# EAGLE design xbee_compat (EAGLE 6.1)
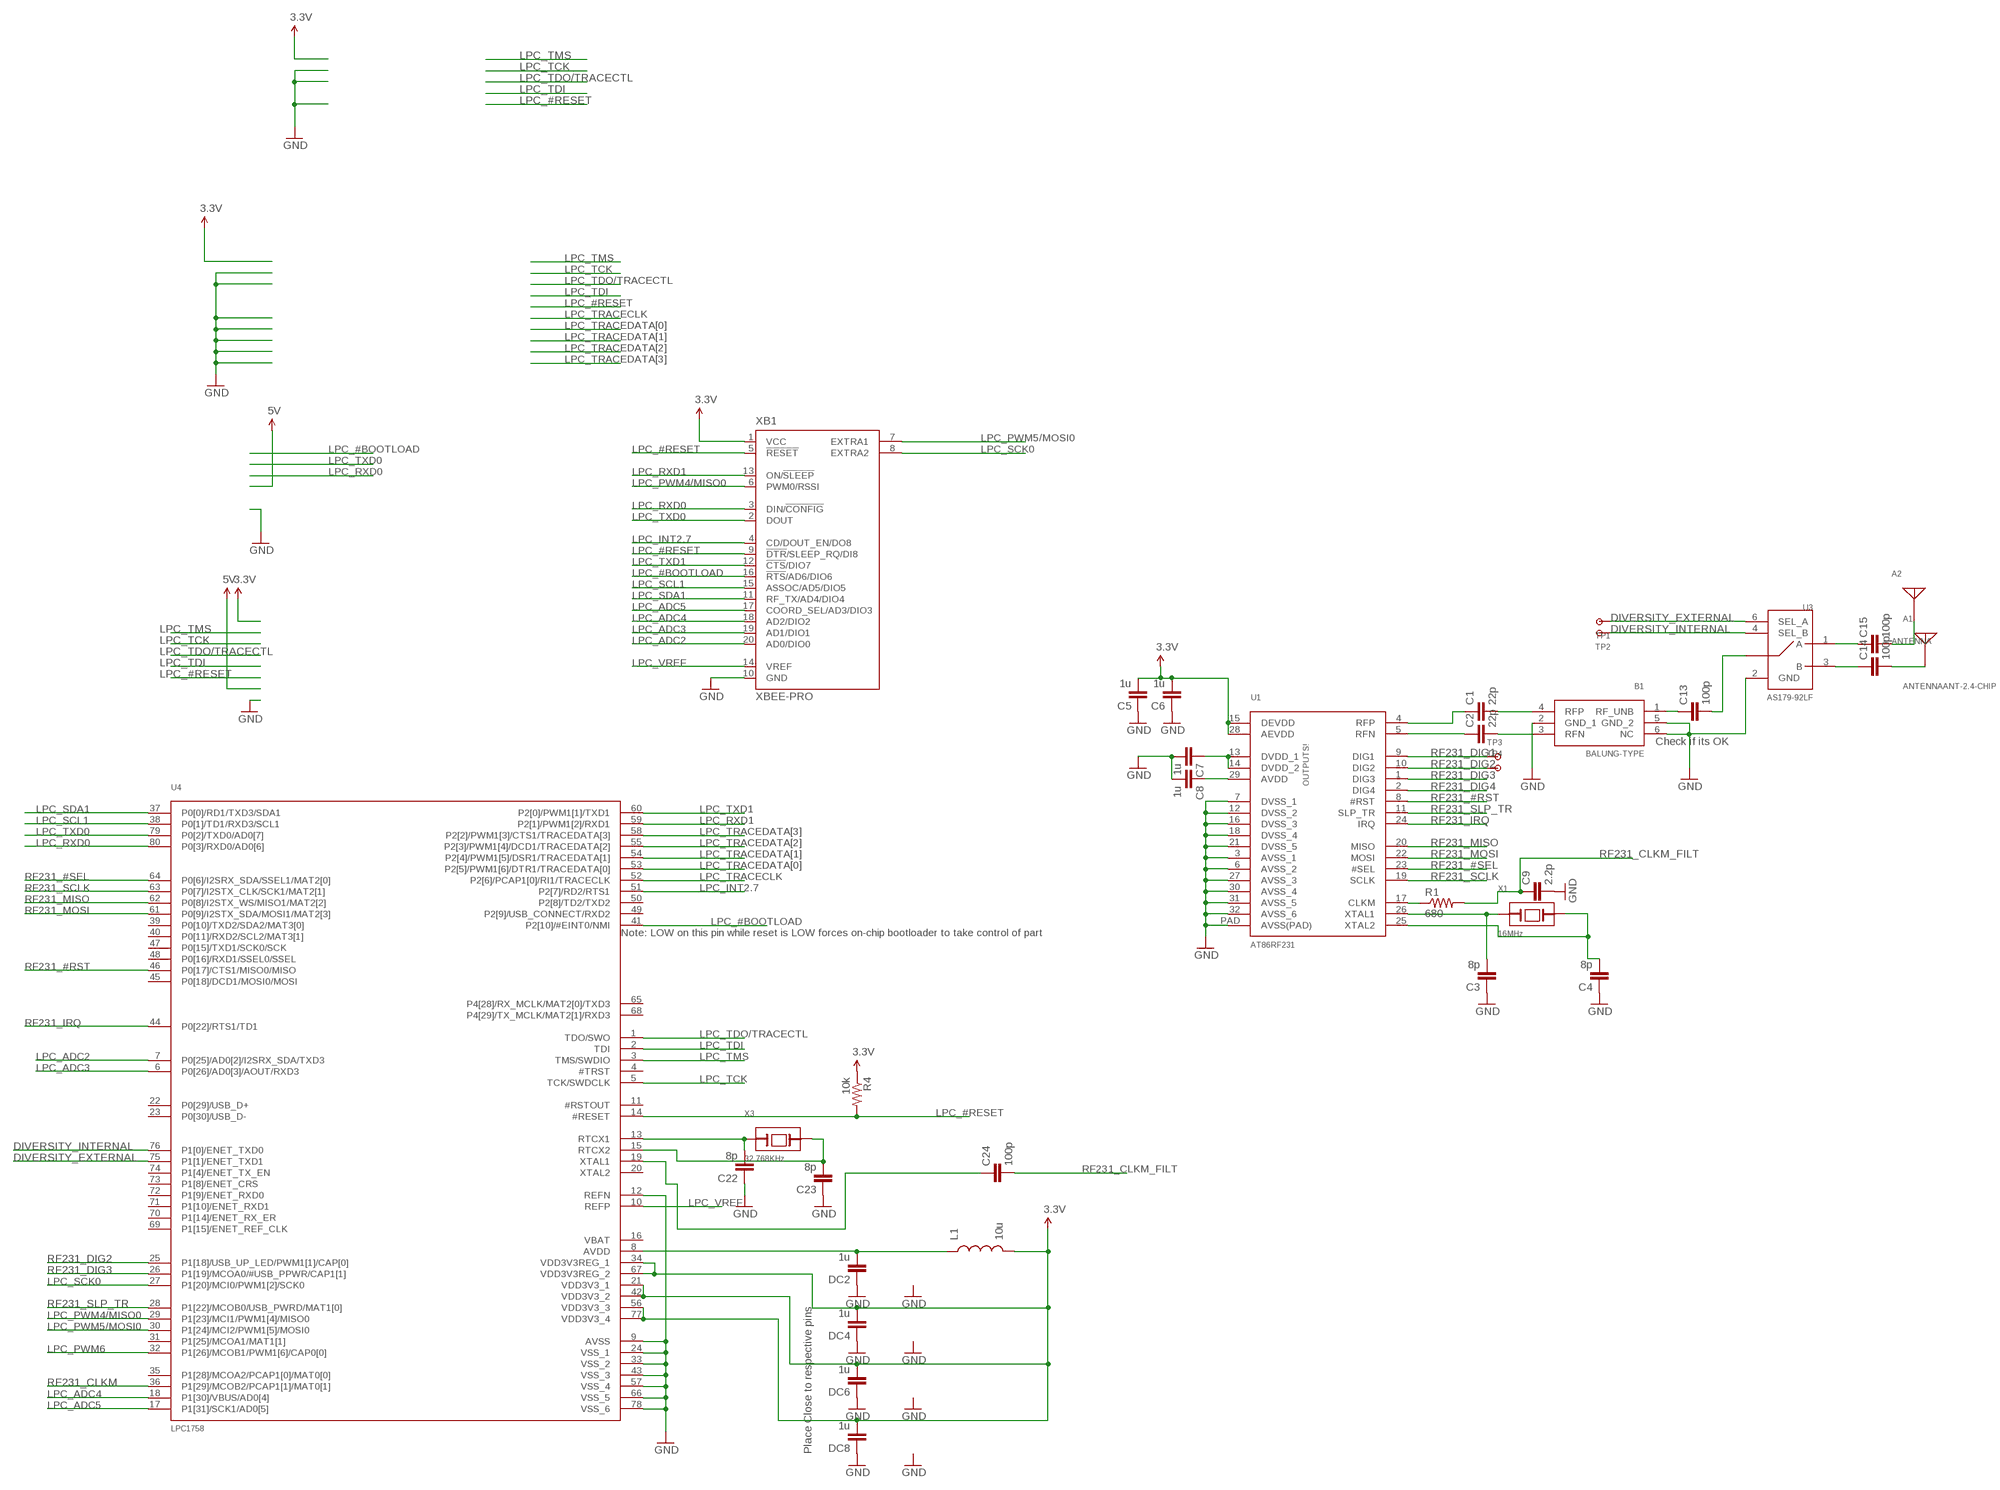
[diagram p0: schematic, sheet 1]

## Parts
A1  ANTENNAANT-2.4-CHIP  [ANT-2.4-CHP]
A2  ANTENNA  [CONREVSMA003.031]
B1  BALUNG-TYPE  [MURATA_LDB_BALUN]
C1  22p  CAP0402  [C0402]
C2  22p  CAP0402  [C0402]
C3  8p  CAP0402  [C0402]
C4  8p  CAP0402  [C0402]
C5  1u  CAP0402  [C0402]
C6  1u  CAP0402  [C0402]
C7  1u  CAP0402  [C0402]
C8  1u  CAP0402  [C0402]
C9  2.2p  CAP0402  [C0402]
C13  100p  CAP0402  [C0402]
C14  100p  CAP0402  [C0402]
C15  100p  CAP0402  [C0402]
C22  8p  CAP0402  [C0402]
C23  8p  CAP0402  [C0402]
C24  100p  CAP0402  [C0402]
DC2  1u  CAP0402  [C0402]
DC4  1u  CAP0402  [C0402]
DC6  1u  CAP0402  [C0402]
DC8  1u  CAP0402  [C0402]
L1  10u  INDUCTOR0603  [0603]
R1  680  RESISTOR0402  [C0402]
R4  10k  RESISTOR0402  [C0402]
TP1  TESTPOINTSMALLEST  [TESTPOINT]
TP2  TESTPOINTSMALLEST  [TESTPOINT]
TP3  TESTPOINTSMALLEST  [TESTPOINT]
TP4  TESTPOINTSMALLEST  [TESTPOINT]
U1  AT86RF231  [ATRF231_32QN2]
U3  AS179-92LF  [SC-70]
U4  LPC1758  [LPC1758_LQFP80]
X1  16MHz  XTALCX3225SA  [CX3225SA]
X3  32.768KHz  XTALABS07  [ABS07]
XB1  XBEE-PRO  [XBEE-PRO]

## Nets
3.3V [Power]: C5.2 C6.2 DC4.2 DC6.2 DC8.2 L1.2 R4.1 U1.15(DEVDD) U1.28(AEVDD) U4.21(VDD3V3_1) U4.34(VDD3V3REG_1) U4.42(VDD3V3_2) U4.56(VDD3V3_3) U4.67(VDD3V3REG_2) U4.77(VDD3V3_4) XB1.1(VCC)
DIVERSITY_EXTERNAL: TP1.P$1 U3.6(SEL_A) U4.75(P1[1]/ENET_TXD1)
DIVERSITY_INTERNAL: TP2.P$1 U3.4(SEL_B) U4.76(P1[0]/ENET_TXD0)
GND [Power]: B1.2(GND_1) B1.5(GND_2) B1.6(NC) C3.1 C4.1 C5.1 C6.1 C7.2 C8.2 C9.2 C22.1 C23.1 DC2.1 DC4.1 DC6.1 DC8.1 U1.3(AVSS_1) U1.6(AVSS_2) U1.7(DVSS_1) U1.12(DVSS_2) U1.16(DVSS_3) U1.18(DVSS_4) U1.21(DVSS_5) U1.27(AVSS_3) U1.30(AVSS_4) U1.31(AVSS_5) U1.32(AVSS_6) U1.PAD(AVSS(PAD)) U3.2(GND) U4.9(AVSS) U4.12(REFN) U4.24(VSS_1) U4.33(VSS_2) U4.43(VSS_3) U4.57(VSS_4) U4.66(VSS_5) U4.78(VSS_6) XB1.10(GND)
LPC_#BOOTLOAD: U4.41(P2[10]/#EINT0/NMI) XB1.16(!RTS!/AD6/DIO6)
LPC_#RESET: R4.2 U4.14(#RESET) XB1.5(!RESET) XB1.9(!DTR!/SLEEP_RQ/DI8)
LPC_ADC2: U4.7(P0[25]/AD0[2]/I2SRX_SDA/TXD3) XB1.20(AD0/DIO0)
LPC_ADC3: U4.6(P0[26]/AD0[3]/AOUT/RXD3) XB1.19(AD1/DIO1)
LPC_ADC4: U4.18(P1[30]/VBUS/AD0[4]) XB1.18(AD2/DIO2)
LPC_ADC5: U4.17(P1[31]/SCK1/AD0[5]) XB1.17(COORD_SEL/AD3/DIO3)
LPC_INT2.7: U4.51(P2[7]/RD2/RTS1) XB1.4(CD/DOUT_EN/DO8)
LPC_PWM4/MISO0: U4.29(P1[23]/MCI1/PWM1[4]/MISO0) XB1.6(PWM0/RSSI)
LPC_PWM5/MOSI0: U4.30(P1[24]/MCI2/PWM1[5]/MOSI0) XB1.7(EXTRA1)
LPC_PWM6: U4.32(P1[26]/MCOB1/PWM1[6]/CAP0[0])
LPC_RXD0: U4.80(P0[3]/RXD0/AD0[6]) XB1.3(DIN/!CONFIG)
LPC_RXD1: U4.59(P2[1]/PWM1[2]/RXD1) XB1.13(ON/!SLEEP)
LPC_SCK0: U4.27(P1[20]/MCI0/PWM1[2]/SCK0) XB1.8(EXTRA2)
LPC_SCL1: U4.38(P0[1]/TD1/RXD3/SCL1) XB1.15(ASSOC/AD5/DIO5)
LPC_SDA1: U4.37(P0[0]/RD1/TXD3/SDA1) XB1.11(RF_TX/AD4/DIO4)
LPC_TCK: U4.5(TCK/SWDCLK)
LPC_TDI: U4.2(TDI)
LPC_TDO/TRACECTL: U4.1(TDO/SWO)
LPC_TMS: U4.3(TMS/SWDIO)
LPC_TRACECLK: U4.52(P2[6]/PCAP1[0]/RI1/TRACECLK)
LPC_TRACEDATA[0]: U4.53(P2[5]/PWM1[6]/DTR1/TRACEDATA[0])
LPC_TRACEDATA[1]: U4.54(P2[4]/PWM1[5]/DSR1/TRACEDATA[1])
LPC_TRACEDATA[2]: U4.55(P2[3]/PWM1[4]/DCD1/TRACEDATA[2])
LPC_TRACEDATA[3]: U4.58(P2[2]/PWM1[3]/CTS1/TRACEDATA[3])
LPC_TXD0: U4.79(P0[2]/TXD0/AD0[7]) XB1.2(DOUT)
LPC_TXD1: U4.60(P2[0]/PWM1[1]/TXD1) XB1.12(!CTS!/DIO7)
LPC_VREF: U4.10(REFP) XB1.14(VREF)
N$1 [RF]: B1.3(RFN) C2.2
N$2 [RF]: B1.4(RFP) C1.2
N$3: B1.1(RF_UNB) C13.1
N$4 [RF]: C2.1 U1.5(RFN)
N$5 [RF]: C1.1 U1.4(RFP)
N$6: C3.2 U1.26(XTAL1) X1.3(A)
N$7: C4.2 U1.25(XTAL2) X1.1(B)
N$9: C8.1 U1.29(AVDD)
N$10: C7.1 U1.13(DVDD_1) U1.14(DVDD_2)
N$14: R1.1 U1.17(CLKM)
N$15 [RF]: C13.2 U3.5(W)
N$16 [RF]: C14.1 U3.3(B)
N$17 [RF]: C15.1 U3.1(A)
N$19 [RF]: A1.CON C14.2
N$20 [RF]: A2.CON C15.2
N$24: DC2.2 L1.1 U4.8(AVDD)
N$25: C22.2 U4.13(RTCX1) X3.1(A)
N$26: C23.2 U4.15(RTCX2) X3.2(B)
N$27: C24.1 U4.19(XTAL1)
RF231_#RST: U1.8(#RST) U4.46(P0[17]/CTS1/MISO0/MISO)
RF231_#SEL: U1.23(#SEL) U4.64(P0[6]/I2SRX_SDA/SSEL1/MAT2[0])
RF231_CLKM: U4.36(P1[29]/MCOB2/PCAP1[1]/MAT0[1])
RF231_CLKM_FILT: C9.1 C24.2 R1.2
RF231_DIG1: TP3.P$1 U1.9(DIG1)
RF231_DIG2: TP4.P$1 U1.10(DIG2) U4.25(P1[18]/USB_UP_LED/PWM1[1]/CAP[0])
RF231_DIG3: U1.1(DIG3) U4.26(P1[19]/MCOA0/#USB_PPWR/CAP1[1])
RF231_DIG4: U1.2(DIG4)
RF231_IRQ: U1.24(IRQ) U4.44(P0[22]/RTS1/TD1)
RF231_MISO: U1.20(MISO) U4.62(P0[8]/I2STX_WS/MISO1/MAT2[2])
RF231_MOSI: U1.22(MOSI) U4.61(P0[9]/I2STX_SDA/MOSI1/MAT2[3])
RF231_SCLK: U1.19(SCLK) U4.63(P0[7]/I2STX_CLK/SCK1/MAT2[1])
RF231_SLP_TR: U1.11(SLP_TR) U4.28(P1[22]/MCOB0/USB_PWRD/MAT1[0])
Unconnected: U4.4(#TRST) U4.11(#RSTOUT) U4.16(VBAT) U4.20(XTAL2) U4.22(P0[29]/USB_D+) U4.23(P0[30]/USB_D-) U4.31(P1[25]/MCOA1/MAT1[1]) U4.35(P1[28]/MCOA2/PCAP1[0]/MAT0[0]) U4.39(P0[10]/TXD2/SDA2/MAT3[0]) U4.40(P0[11]/RXD2/SCL2/MAT3[1]) U4.45(P0[18]/DCD1/MOSI0/MOSI) U4.47(P0[15]/TXD1/SCK0/SCK) U4.48(P0[16]/RXD1/SSEL0/SSEL) U4.49(P2[9]/USB_CONNECT/RXD2) U4.50(P2[8]/TD2/TXD2) U4.65(P4[28]/RX_MCLK/MAT2[0]/TXD3) U4.68(P4[29]/TX_MCLK/MAT2[1]/RXD3) U4.69(P1[15]/ENET_REF_CLK) U4.70(P1[14]/ENET_RX_ER) U4.71(P1[10]/ENET_RXD1) U4.72(P1[9]/ENET_RXD0) U4.73(P1[8]/ENET_CRS) U4.74(P1[4]/ENET_TX_EN)

## Notes on the sheet
- Check if its OK
- Note: LOW on this pin while reset is LOW forces on-chip bootloader to take control of part
- Place Close to respective pins

## Library data of the parts
A1 A2 = WSNlib:ANTENNA: Antennas ANT-2.4-CHP-x RPSMA connector
B1 = WSNlib:BALUN
C1-C9 C13-C15 C22-C24 DC2 DC4 DC6 DC8 = SparkFun:CAP: Capacitor Standard 0603 ceramic capacitor, and 0.1" leaded capacitor.
L1 = SparkFun:INDUCTOR: Inductors Basic Inductor/Choke - 0603 and 1206. Footprints are not proven and vary greatly between part numbers.
R1 R4 = SparkFun:RESISTOR: Resistor Basic schematic elements and footprints for 0603, 1206, and PTH 1/10th watt (small) resistors.
TP1-TP4 = WSNlib:TESTPOINT: Generic Testpoint
U1 = WSNlib:AT86RF231: ATRF231 Radio Tranciever
U3 = WSNlib:AS179-92LF: AS179-92LF 2.4GHz GaAs SPDT Switch
U4 = WSNlib:LPC1758
X1 X3 = WSNlib:XTAL: Crystals used in OpenMote
XB1 = WSNlib:XBEE: XBee (TM) /XBee-PRO(TM) OEM RF Modules Source: MaxStream, Inc. xbee_productmanual.pdf

## Net classes
0 default: width 0.152 mm, drill 0.152 mm, clearance 0.152 mm
1 RF: width 0.254 mm, drill 2.54 mm, clearance 0.152 mm
2 Power: width 0.152 mm, drill 0.152 mm, clearance 0.152 mm

## Board
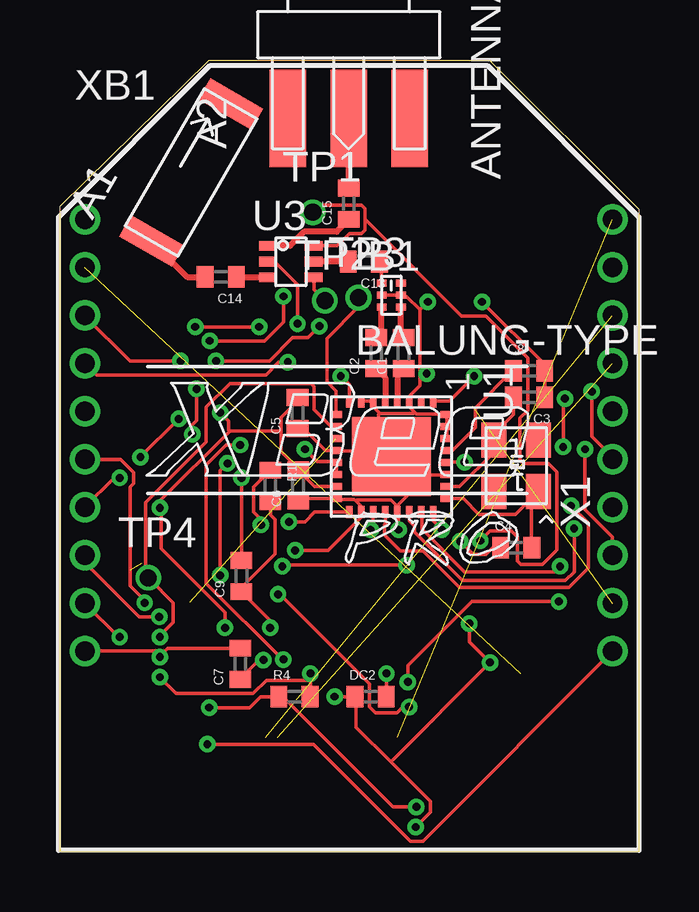
[diagram p1: board, top side]
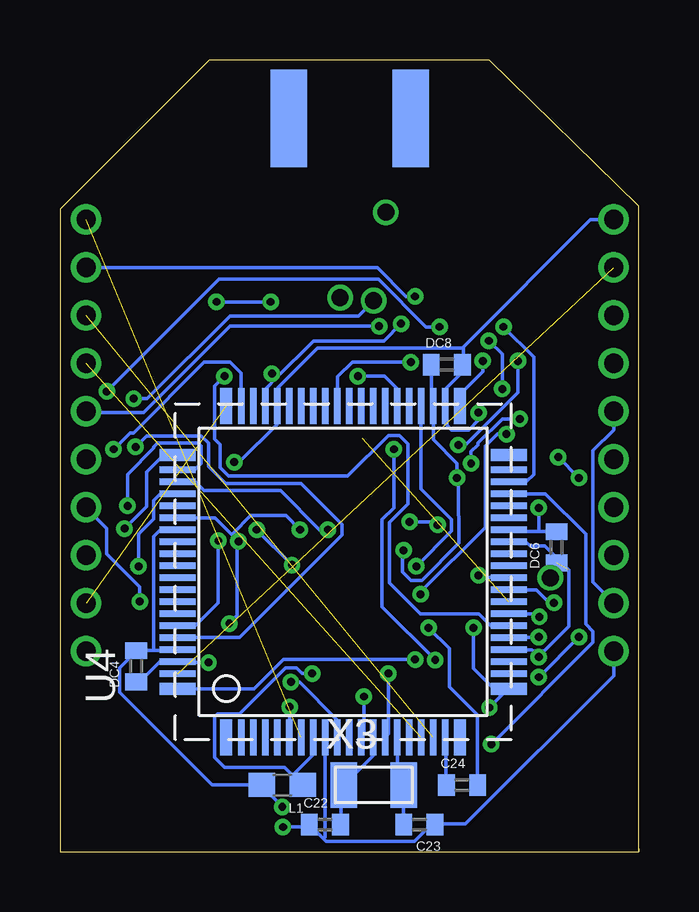
[diagram p2: board, bottom side, seen from below]

Size 24.13 x 33.02 mm. Coordinates in mm from the lower left corner, seen from the top.
Outline: 0,0 0,0.13
Outline: 0,0.13 0,26.92 6.22,33.02 17.91,33.02 24.13,26.8 24.13,0 0,0
Outline: 0,0 0,0.13
Outline: 0,0.13 0,0
Copper layers (1*16): Top 0.0356mm / dielectric 1.5011mm / Bottom 0.0356mm
Design rules: minimum track width 6mil, minimum drill 13mil, track to track 6mil, track to pad 6mil, pad to pad 6mil, via to via 6mil, smd to smd 6mil, copper to edge 15mil, drill to drill 6mil, minimum pad ring 7mil, minimum via ring 7mil, stop-mask expansion 4mil, vias tented up to drill 0mil, thermal gap 10mil
tRestrict: area 1.3,25.3 to 8.6,32.8

### Footprints (pad centres in the part's own frame; a part is rotated, then mirrored left to right if it is on the bottom)
ANT-2.4-CHP = smd 1.016 x 2.54: CON -3.302,0; MEC 3.302,0
CONREVSMA003.031 = smd 1.524 x 4.064: CON 0,0; GND_2 -2.54,0; GND_4 2.54,0 | smd 1.524 x 4.064 bottom: GND_1 -2.54,0; GND_3 2.54,0
MURATA_LDB_BALUN = smd 0.4 x 0.3: 1 -0.4,0.5; 2 -0.4,0; 3 -0.4,-0.5; 4 0.4,-0.5; 5 0.4,0; 6 0.4,0.5
C0402 = smd 0.7 x 0.9: 1 -0.65,0; 2 0.65,0
0603 = smd 1.1 x 1: 1 -0.85,0; 2 0.85,0
TESTPOINT = drill 0.711 pad 1.016: P$1 0,0
ATRF231_32QN2 = smd 0.5 x 0.28: 1 -2.3,1.75; 2 -2.3,1.25; 3 -2.3,0.75; 4 -2.3,0.25; 5 -2.3,-0.25; 6 -2.3,-0.75; 7 -2.3,-1.25; 8 -2.3,-1.75; 17 2.3,-1.75; 18 2.3,-1.25; 19 2.3,-0.75; 20 2.3,-0.25; 21 2.3,0.25; 22 2.3,0.75; 23 2.3,1.25; 24 2.3,1.75 | smd 0.28 x 0.5: 9 -1.75,-2.3; 10 -1.25,-2.3; 11 -0.75,-2.3; 12 -0.25,-2.3; 13 0.25,-2.3; 14 0.75,-2.3; 15 1.25,-2.3; 16 1.75,-2.3; 25 1.75,2.3; 26 1.25,2.3; 27 0.75,2.3; 28 0.25,2.3; 29 -0.25,2.3; 30 -0.75,2.3; 31 -1.25,2.3; 32 -1.75,2.3 | smd 3.3 x 3.3: PAD 0,0
SC-70 = smd 0.75 x 0.4: 1 -0.95,0.65; 2 -0.95,0; 3 -0.95,-0.65; 4 0.95,-0.65; 5 0.95,0; 6 0.95,0.65
LPC1758_LQFP80 = smd 1.5 x 0.5: 1 -6.9,4.875; 20 -6.9,-4.875; 41 6.9,-4.875; 60 6.9,4.875 | smd 1.5 x 0.28: 2 -6.9,4.25; 3 -6.9,3.75; 4 -6.9,3.25; 5 -6.9,2.75; 6 -6.9,2.25; 7 -6.9,1.75; 8 -6.9,1.25; 9 -6.9,0.75; 10 -6.9,0.25; 11 -6.9,-0.25; 12 -6.9,-0.75; 13 -6.9,-1.25; 14 -6.9,-1.75; 15 -6.9,-2.25; 16 -6.9,-2.75; 17 -6.9,-3.25; 18 -6.9,-3.75; 19 -6.9,-4.25; 42 6.9,-4.25; 43 6.9,-3.75; 44 6.9,-3.25; 45 6.9,-2.75; 46 6.9,-2.25; 47 6.9,-1.75; 48 6.9,-1.25; 49 6.9,-0.75; 50 6.9,-0.25; 51 6.9,0.25; 52 6.9,0.75; 53 6.9,1.25; 54 6.9,1.75; 55 6.9,2.25; 56 6.9,2.75; 57 6.9,3.25; 58 6.9,3.75; 59 6.9,4.25 | smd 0.5 x 1.5: 21 -4.875,-6.9; 40 4.875,-6.9; 61 4.875,6.9; 80 -4.875,6.9 | smd 0.28 x 1.5: 22 -4.25,-6.9; 23 -3.75,-6.9; 24 -3.25,-6.9; 25 -2.75,-6.9; 26 -2.25,-6.9; 27 -1.75,-6.9; 28 -1.25,-6.9; 29 -0.75,-6.9; 30 -0.25,-6.9; 31 0.25,-6.9; 32 0.75,-6.9; 33 1.25,-6.9; 34 1.75,-6.9; 35 2.25,-6.9; 36 2.75,-6.9; 37 3.25,-6.9; 38 3.75,-6.9; 39 4.25,-6.9; 62 4.25,6.9; 63 3.75,6.9; 64 3.25,6.9; 65 2.75,6.9; 66 2.25,6.9; 67 1.75,6.9; 68 1.25,6.9; 69 0.75,6.9; 70 0.25,6.9; 71 -0.25,6.9; 72 -0.75,6.9; 73 -1.25,6.9; 74 -1.75,6.9; 75 -2.25,6.9; 76 -2.75,6.9; 77 -3.25,6.9; 78 -3.75,6.9; 79 -4.25,6.9
CX3225SA = smd 1.45 x 1.05: 1 -1.075,-0.925; 2 1.075,-0.925; 3 1.075,0.925; 4 -1.075,0.925
ABS07 = smd 1.1 x 1.9: 1 -1.25,0; 2 1.25,0
XBEE-PRO = drill 0.8 pad 1.27: 1 -11,9; 2 -11,7; 3 -11,5; 4 -11,3; 5 -11,1; 6 -11,-1; 7 -11,-3; 8 -11,-5; 9 -11,-7; 10 -11,-9; 11 11,-9; 12 11,-7; 13 11,-5; 14 11,-3; 15 11,-1; 16 11,1; 17 11,3; 18 11,5; 19 11,7; 20 11,9

### Placement (x,y rotation side)
A1  5.47,28.33 60 top
A2  12.04,30.58 0 top
B1  13.82,23.22 0 top
C1  14.33,20.8 90 top
C2  13.18,20.8 90 top
C3  19.56,18.96 180 top
C4  19.02,12.69 0 top
C5  9.91,18.3 90 top
C6  9.93,15.28 90 top
C7  7.52,7.85 90 top
C8  19.56,20.07 0 top
C9  7.57,11.51 90 top
C13  12.67,24.61 180 top
C14  6.71,23.98 180 top
C15  12.04,27.03 90 top
C22  13.08,1.14 0 bottom
C23  9.14,1.14 180 bottom
C24  7.37,2.79 0 bottom
DC2  12.95,6.48 0 top
DC4  20.95,7.75 90 bottom
DC6  3.43,12.7 90 bottom
DC8  8,20.32 0 bottom
L1  14.86,2.79 180 bottom
R1  8.78,15.27 270 top
R4  9.78,6.48 0 top
TP1  10.54,26.67 0 top
TP2  11.05,22.99 0 top
TP3  12.45,23.11 0 top
TP4  3.68,11.43 0 top
U1  13.82,16.48 270 top
U3  9.63,24.61 0 top
U4  12.32,11.68 90 bottom
X1  19.02,16.1 90 top
X3  11.05,2.79 0 bottom
XB1  12.04,17.37 0 top

### Tracks (layer width: path | path; a pad name or v marks a point on that pad's centre or on a via)
3.3V  (via drill 0.33)
  Top 0.152: v6.22,6.02 7.9,6.02 8.36,6.48 9.12,6.48 R4.1 9.2,6.45 9.32,6.45 13.89,1.88 v14.86,1.88 | U1.15 11.51,15.24 10.62,15.24 C6.2 9.91,16 9.22,16.69 9.22,17.55 | 9.22,17.55 9.22,18.11 9.91,18.8 C5.2 | 7.09,17.55 4.17,14.63 v4.17,14.35 4.22,14.3 4.22,12.65 6.88,9.98 v6.88,9.35 | 7.09,17.55 9.17,17.55 9.22,17.55 | v16.87,16.26 16.13,16.26 U1.28 | v6.68,18.31 7.04,17.96 7.04,17.6 7.09,17.55
  Bottom 0.152: 5.74,6.5 5.44,6.81 U4.21 | 5.74,6.5 v6.22,6.02 | 20.22,8.41 19.25,8.41 U4.77 | 20.22,8.41 DC4.2 20.98,8.33 21.64,7.67 21.64,6.66 17.78,2.79 15.72,2.79 L1.2 15.72,2.74 v14.86,1.88 | U4.67 19.23,13.41 19.96,13.41 20.22,13.16 20.22,8.46 20.22,8.41 | 4.17,13.36 5.36,13.36 5.41,13.41 U4.34 | 4.17,13.36 DC6.2 | v4.17,14.35 4.17,13.41 4.17,13.36 | v16.87,16.26 16.66,16.26 15.09,17.83 15.09,18.57 U4.56 15.04,18.64 15.04,19.36 13.39,21.01 7.37,21.01 7.32,21.01 | 7.32,21.01 7.32,21.06 2.01,26.36 XB1.1 | 7.32,21.01 7.32,20.37 DC8.2 7.37,20.32 7.37,19.99 8.05,19.3 8.05,18.59 U4.42 8.05,18.52 8.05,17.86 7.8,17.6 7.09,17.6 6.68,18.01 v6.68,18.31 | v6.88,9.35 6.88,7.64 5.79,6.55 5.74,6.5
DIVERSITY_EXTERNAL  (via drill 0.33)
  Top 0.152: 12.72,26.31 12.72,26.82 12.57,26.98 10.85,26.98 TP1.P$1 | 12.72,26.31 12.72,25.93 12.57,25.78 12.06,25.78 11.56,25.27 10.59,25.27 U3.6 | v17.53,12.98 17.93,13.39 18.82,13.39 19.07,13.13 19.07,12.14 19.23,11.99 20.12,11.99 20.73,12.6 20.73,15.85 20.37,16.2 19.33,16.2 19.18,16.36 19.18,18.09 19.51,18.41 19.51,20.6 17.75,22.35 16.74,22.35 12.78,26.31 12.72,26.31
  Bottom 0.152: v17.53,12.98 17.53,10.39 18.47,9.45 19.2,9.45 U4.75
DIVERSITY_INTERNAL  (via drill 0.33)
  Top 0.152: TP2.P$1 10.59,23.44 10.59,23.95 U3.4 | v20.98,16.89 20.98,18.82 v21.06,18.9
  Bottom 0.152: v20.98,16.89 20.52,17.35 18.24,17.35 17.93,17.04 17.93,16.08 17.22,15.37 14.07,15.37 12.37,13.66 12.37,13.21 16.64,8.94 19.2,8.94 U4.76 | v21.06,18.9 20.5,18.9 17.04,22.35 11.68,22.35 TP2.P$1
GND  (via drill 0.33)  (1 unrouted)
  Top 0.152: v7.57,15.6 C9.2 | v16.69,12.95 17.25,12.39 17.75,12.39 18.03,12.68 18.36,12.68 C4.1 | C6.1 10.03,14.73 11.51,14.73 U1.16 11.58,14.71 12.27,14.71 12.34,14.63 | 12.34,14.63 12.55,14.43 12.55,14.2 U1.18 12.55,14.12 12.55,13.95 11.18,12.57 v9.8,12.57 | 14.05,14.43 14.05,14.2 U1.21 14.12,14.15 v14.12,13.44 | 14.05,14.43 13.79,14.68 12.39,14.68 12.34,14.63 | 14.96,15.34 14.1,14.48 14.05,14.43 | 14.96,15.34 15.34,15.72 16.1,15.72 U1.27 | v9.91,22.02 9.91,23.65 8.94,24.61 U3.2 | C5.1 9.91,17.63 10.19,17.63 11.07,16.74 11.51,16.74 U1.12 11.58,16.71 13.59,16.71 U1.PAD | C3.1 20.22,18.97 C8.2 20.17,20.12 20.17,20.37 v17.6,22.94 | B1.2 13.44,23.22 14.2,23.22 B1.5 | B1.6 14.22,23.7 14.22,23.27 B1.5 | U1.7 12.57,18.8 13.06,18.8 U1.6 13.11,18.72 13.11,18.52 13.34,18.29 | U1.30 16.13,17.25 U1.31 16.13,17.8 16.13,18.21 U1.32 16.05,18.26 14.86,18.26 14.78,18.34 | 14.78,18.34 14.58,18.54 U1.3 14.61,18.85 14.61,19.05 15.01,19.46 15.01,19.94 | 13.34,18.29 14.73,18.29 14.78,18.34 | 15.01,22.61 14.45,23.16 14.28,23.16 B1.5 | 15.01,19.94 15.01,22.61 | v15.34,22.94 15.06,22.66 15.01,22.61 | U1.PAD 13.28,16.76 13.28,18.24 13.34,18.29 | v15.29,19.94 15.06,19.94 15.01,19.94 | 14.96,15.34 14.91,15.39 13.87,16.43 U1.PAD | 1.04,8.38 4.17,8.38 | 4.17,8.38 4.39,8.38 4.5,8.48 7.52,8.48 C7.2 | 1.04,8.38 XB1.10 | 1.04,8.38 XB1.10 | 1.04,8.38 XB1.10 | v4.17,8.13 4.17,8.33 4.17,8.38 | v11.46,6.48 DC2.1 12.34,6.43 12.34,5.21 13.79,3.76 | 13.79,3.76 15.44,2.11 15.44,1.65 v14.83,1.04 | 13.79,3.76 13.84,3.81 v17.93,7.9 17.88,7.95 17.07,8.76 v17.07,9.53
  Bottom 0.152: DC8.1 8.64,20.32 8.64,18.62 U4.43 8.56,18.57 8.56,17.2 7.57,16.2 v7.57,15.6 7.52,15.54 7.52,14.02 7.49,13.99 7.49,12.88 9.04,11.33 9.5,11.33 9.86,11.68 9.86,12.52 v9.8,12.57 | 16.97,13.23 17.65,13.92 19.2,13.92 U4.66 | 16.97,13.23 v16.69,12.95 16.74,12.9 16.74,9.86 v17.07,9.53 | v14.12,13.44 14.71,14.02 16.18,14.02 16.92,13.28 16.97,13.23 | v9.91,22.02 10.62,21.31 13.56,21.31 15.11,19.76 | 15.11,19.76 15.54,19.33 15.54,18.59 U4.57 | v15.34,22.94 v17.6,22.94 | v15.29,19.94 15.16,19.81 15.11,19.76 | 4.17,8.38 3.94,8.38 2.92,9.4 2.92,11.76 3.91,12.75 4.52,12.75 4.7,12.93 U4.33 | 4.17,8.38 4.39,8.38 4.45,8.43 U4.24 | v4.17,8.13 4.17,8.33 4.17,8.38 | DC4.1 20.95,7.11 20.78,7.11 19.96,7.92 U4.78 19.15,7.9 v17.93,7.9 | v11.46,6.48 11.46,4.9 11.56,4.8 U4.12 | 13.13,0.56 13.72,1.14 C22.1 13.72,1.04 v14.83,1.04 | 13.13,0.56 13.03,0.46 9.35,0.46 8.66,1.14 8.51,1.14 C23.1 8.43,1.17 7.21,1.17 1.04,7.34 1.04,8.36 XB1.10 | U4.9 13.08,0.61 13.13,0.56
LPC_#BOOTLOAD  (via drill 0.33)
  Top 0.152: v6.5,20.47 8.74,20.47 9.7,21.44 10.34,21.44 v10.82,21.92
  Bottom 0.152: v6.5,20.47 6.5,20.04 7.44,19.1 7.44,18.59 U4.41 | v10.82,21.92 17.04,21.92 20.65,18.31 22.99,18.31 XB1.16
LPC_#RESET  (via drill 0.33)
  Top 0.152: R4.2 v10.44,7.44 10.39,7.16 8.61,7.16 8.05,6.6 4.85,6.6 v4.17,7.29 | v2.49,8.97 2.44,8.97 XB1.9
  Bottom 0.152: v10.44,7.44 10.44,4.93 10.57,4.8 U4.14 | v2.49,8.97 v4.17,7.29 | XB1.5 1.04,17.6 1.91,16.74 1.91,11.25 1.04,10.39 XB1.9
LPC_ADC2  (1 unrouted)
LPC_ADC3  (via drill 0.33)
  Top 0.152: v14.55,6.04 14.3,6.04 14.05,5.79 13.16,5.79 12.9,6.04 12.9,7.01 9.17,10.74 v9.09,10.74 | v5.51,17.42 5.51,17.8 5.69,17.98 v5.69,19.3 | v6.25,21.31 8.53,21.31 9.32,22.1 v9.32,23.16
  Bottom 0.152: v14.55,6.04 14.55,4.8 U4.6 | v9.09,10.74 9.09,10.85 6.4,13.54 6.4,16.92 5.89,17.42 v5.51,17.42 | v5.69,19.3 5.69,20.75 v6.25,21.31 | v9.32,23.16 9.7,23.16 10.9,24.36 XB1.19
LPC_ADC4  (1 unrouted)
LPC_ADC5  (1 unrouted)
LPC_INT2.7  (via drill 0.33)
  Top 0.152: v9.5,20.42 9.12,20.42 8.59,19.89 1.52,19.89 XB1.4
  Bottom 0.152: v9.5,20.42 11.94,20.42 12.55,19.81 12.55,18.59 U4.51
LPC_PWM4/MISO0  (via drill 0.33)
  Top 0.152: v3.53,10.39 3.53,10.49 2.92,11.1 2.92,15.21 3.07,15.37 3.07,15.82 2.54,16.36 1.04,16.36 XB1.6
  Bottom 0.152: v3.53,10.39 3.73,10.39 4.27,10.92 U4.29
LPC_PWM5/MOSI0  (via drill 0.33)
  Top 0.152: v6.68,11.53 6.68,15.9 v6.99,16.2 | v3.35,16.46 v4.95,18.06 | v2.49,15.6 2.26,15.6 XB1.7
  Bottom 0.152: v6.68,11.53 6.6,11.46 5.44,11.46 U4.30 | v6.99,16.2 6.99,16.69 6.71,16.97 6.71,17.04 5.69,18.06 v4.95,18.06 | v2.49,15.6 v3.35,16.46
LPC_RXD0  (via drill 0.33)
  Top 0.152: v9.32,8.03 9.27,8.03 6.1,11.2 6.1,16.13 6.93,16.97 v7.52,16.97 | v5.03,20.47 2.92,20.47 1.04,22.35 XB1.3
  Bottom 0.152: v9.32,8.03 14.81,8.03 16.03,6.81 19.2,6.81 U4.80 | v7.52,16.97 7.21,16.97 5.03,19.15 v5.03,20.47
LPC_RXD1  (via drill 0.33)
  Top 0.152: v21.89,16.79 21.89,14.28 23.04,13.13 23.04,12.39 XB1.13
  Bottom 0.152: v21.89,16.79 21.21,17.48 21.06,17.48 18.11,20.42 17.04,20.42 16.59,19.96 16.59,18.59 U4.59
LPC_SCK0  (via drill 0.33)
  Top 0.152: v4.14,9.8 3.3,9.8 1.04,12.06 XB1.8
  Bottom 0.152: v4.14,9.8 4.27,9.93 U4.27
LPC_SCL1  (via drill 0.33)
  Top 0.152: v8.31,21.89 v5.64,21.89 | v22.17,19.2 22.17,17.32 23.04,16.46 23.04,16.38 XB1.15
  Bottom 0.152: v5.64,21.89 4.37,20.62 4.37,15.75 4.67,15.44 5.41,15.44 U4.38 | v8.31,21.89 8.87,21.89 10.85,23.88 17.5,23.88 v22.17,19.2
LPC_SDA1  (via drill 0.33)
  Top 0.152: v6.15,4.5 10.57,4.5 14.61,0.46 15.14,0.46 23.04,8.36 XB1.11
  Bottom 0.152: v6.15,4.5 1.91,8.74 1.91,9.2 2.21,9.5 2.21,13.26 3.89,14.94 U4.37
LPC_TXD0  (1 unrouted)
LPC_TXD1  (1 unrouted)
LPC_VREF  (via drill 0.33)
  Top 0.152: v14.5,7.09 14.5,7.77 17.17,10.44 v20.8,10.44
  Bottom 0.152: v14.5,7.09 14.15,7.09 12.57,5.51 12.57,4.8 U4.10 | v20.8,10.44 20.8,11.05 22.17,12.42 22.17,13.49 23.04,14.35 XB1.14
N$1
  Top 0.254: B1.3 13.41,22.71 13.41,21.69 13.18,21.46 C2.2
N$2
  Top 0.254: B1.4 14.22,22.71 14.22,21.57 14.33,21.46 C1.2
N$3
  Top 0.152: B1.1 13.41,24.54 13.34,24.61 C13.1
N$4
  Top 0.254: U1.5 13.56,18.8 13.56,19.76 C2.1
N$5
  Top 0.254: U1.4 14.07,18.8 14.07,19.89 C1.1
N$6
  Top 0.152: U1.26 16.66,15.24 18.09,16.66 18.09,17.17 X1.3 18.14,17.25 18.14,17.48 18.9,18.24 18.9,18.95 C3.2
N$7
  Top 0.152: U1.25 16.82,14.73 17.48,14.07 19,14.07 19.94,15.01 X1.1 19.66,14.63 C4.2
N$9
  Top 0.152: U1.29 16.36,16.74 17.32,17.7 17.32,18.52 18.87,20.07 18.9,20.07 C8.1
N$10  (via drill 0.33)
  Top 0.152: U1.14 11.53,15.75 11.53,16.23 U1.13 11.46,16.28 10.72,16.28 v10.21,16.79 | v8.48,8 8.31,8 7.52,7.21 C7.1
  Bottom 0.152: v10.21,16.79 10.21,14.35 10.69,13.87 10.69,10.21 v8.48,8
N$14  (via drill 0.33)
  Top 0.152: v9.55,13.77 10.21,13.77 10.62,14.17 U1.17 | v8.38,13.64 8.38,13.87 8.08,14.17 8.08,15.21 8.76,15.9 R1.1
  Bottom 0.152: v9.55,13.77 8.51,13.77 v8.38,13.64
N$15
  Top 0.254: U3.5 10.59,24.61 C13.2
N$16
  Top 0.254: U3.3 8.66,23.98 C14.1
N$17
  Top 0.254: U3.1 8.69,25.27 9.6,25.27 10.19,25.86 11.53,25.86 12.04,26.36 C15.1
N$19
  Top 0.254: C14.2 6.04,23.98 5.31,23.98 3.83,25.45 A1.CON
N$20
  Top 0.254: A2.CON C15.2
N$24  (via drill 0.33)
  Top 0.152: v13.61,7.44 13.61,6.48 DC2.2
  Bottom 0.152: v13.61,7.44 14.05,7.44 14.28,7.67 14.73,7.67 16.64,5.77 17.55,5.77 17.68,5.64 17.68,3.94 17.27,3.53 14.76,3.53 14.02,2.79 L1.1 14.38,3.25 13.59,4.04 13.59,4.78 U4.8
N$25
  Bottom 0.152: C22.2 12.42,2.69 12.32,2.79 X3.1 12.24,2.85 11.07,4.01 U4.13
N$26
  Bottom 0.152: C23.2 9.8,1.14 X3.2 9.86,2.85 10.06,3.05 10.06,4.78 U4.15
N$27
  Bottom 0.152: C24.1 8.03,4.75 8.05,4.78 U4.19
RF231_#RST  (via drill 0.33)
  Top 0.152: v11.71,19.84 12.06,19.48 12.06,18.8 U1.8
  Bottom 0.152: v11.71,19.84 10.59,19.84 10.08,19.33 10.08,18.59 U4.46
RF231_#SEL  (via drill 0.33)
  Top 0.152: v20.85,11.91 20.62,11.68 16.87,11.68 15.09,13.46 15.09,14.17 U1.23
  Bottom 0.152: v20.85,11.91 20.85,13.26 20.22,13.89 20.22,14.66 19.96,14.91 19.23,14.91 U4.64
RF231_CLKM_FILT  (via drill 0.33)
  Top 0.152: v8.76,9.35 8.76,9.65 7.57,10.85 C9.1 7.59,10.92 7.59,11.05 8.97,12.42 8.97,13.87 8.79,14.05 8.79,14.61 R1.2
  Bottom 0.152: v8.76,9.35 7.9,8.48 7.9,6.88 6.73,5.71 C24.2
RF231_DIG1
  Top 0.152: TP3.P$1 12.45,22.73 11.12,21.41 11.12,19.61 11.51,19.23 11.51,18.24 U1.9
RF231_DIG2  (via drill 0.33)
  Top 0.152: U1.10 11.51,17.75 11.28,17.75 10.59,18.44 10.59,19.41 10.46,19.53 7.09,19.53 6.1,18.54 6.1,17.09 3.58,14.58 3.58,11.53 TP4.P$1 3.73,11.38 4.72,10.39 4.72,9.58 4.17,9.02 v4.17,8.97
  Bottom 0.152: v4.17,8.97 4.19,8.94 5.41,8.94 U4.25
RF231_DIG3  (via drill 0.33)
  Top 0.152: v17.27,19.84 16.23,18.8 15.57,18.8 U1.1
  Bottom 0.152: v17.27,19.84 17.68,19.43 17.68,17.22 17.45,16.99 17.45,16.03 17.09,15.67 12.14,15.67 10.44,17.37 9.98,17.37 9.63,17.02 9.63,14.5 10.39,13.74 10.39,11.23 9.09,9.93 6.66,9.93 6.17,9.45 5.44,9.45 U4.26
RF231_IRQ  (via drill 0.33)
  Top 0.152: v15.93,13.44 15.57,13.79 U1.24 | v14.45,11.96 9.32,11.96 v9.27,11.91
  Bottom 0.152: v14.45,11.96 v15.93,13.44 | v9.27,11.91 7.8,13.39 7.8,13.87 9.07,15.14 9.07,18.57 U4.44
RF231_MISO  (via drill 0.33)
  Top 0.152: v21.31,14.43 22.02,13.72 22.02,11.84 21.21,11.02 16.66,11.02 15.14,12.55 14.2,12.55 13.54,13.21 13.54,13.66 13.56,13.69 U1.20
  Bottom 0.152: v21.31,14.43 21.31,15.75 20.22,16.84 20.22,16.89 20.07,17.04 18.36,17.04 18.24,16.92 18.24,16.2 18.49,15.95 19.2,15.95 U4.62
RF231_MOSI  (via drill 0.33)
  Top 0.152: v21.44,13.49 21.44,11.68 21.08,11.33 16.79,11.33 14.78,13.34 14.78,13.59 14.58,13.79 U1.22
  Bottom 0.152: v21.44,13.49 20.52,14.4 20.52,15.85 19.84,16.54 19.23,16.54 U4.61
RF231_SCLK  (via drill 0.33)
  Top 0.152: v12.95,13.44 13.06,13.54 13.06,14.17 U1.19
  Bottom 0.152: v12.95,13.44 13.31,13.44 14.94,15.06 18.11,15.06 18.47,15.42 19.2,15.42 U4.63
RF231_SLP_TR  (1 unrouted)